# EAGLE schematic Control Board (EAGLE 6.2)
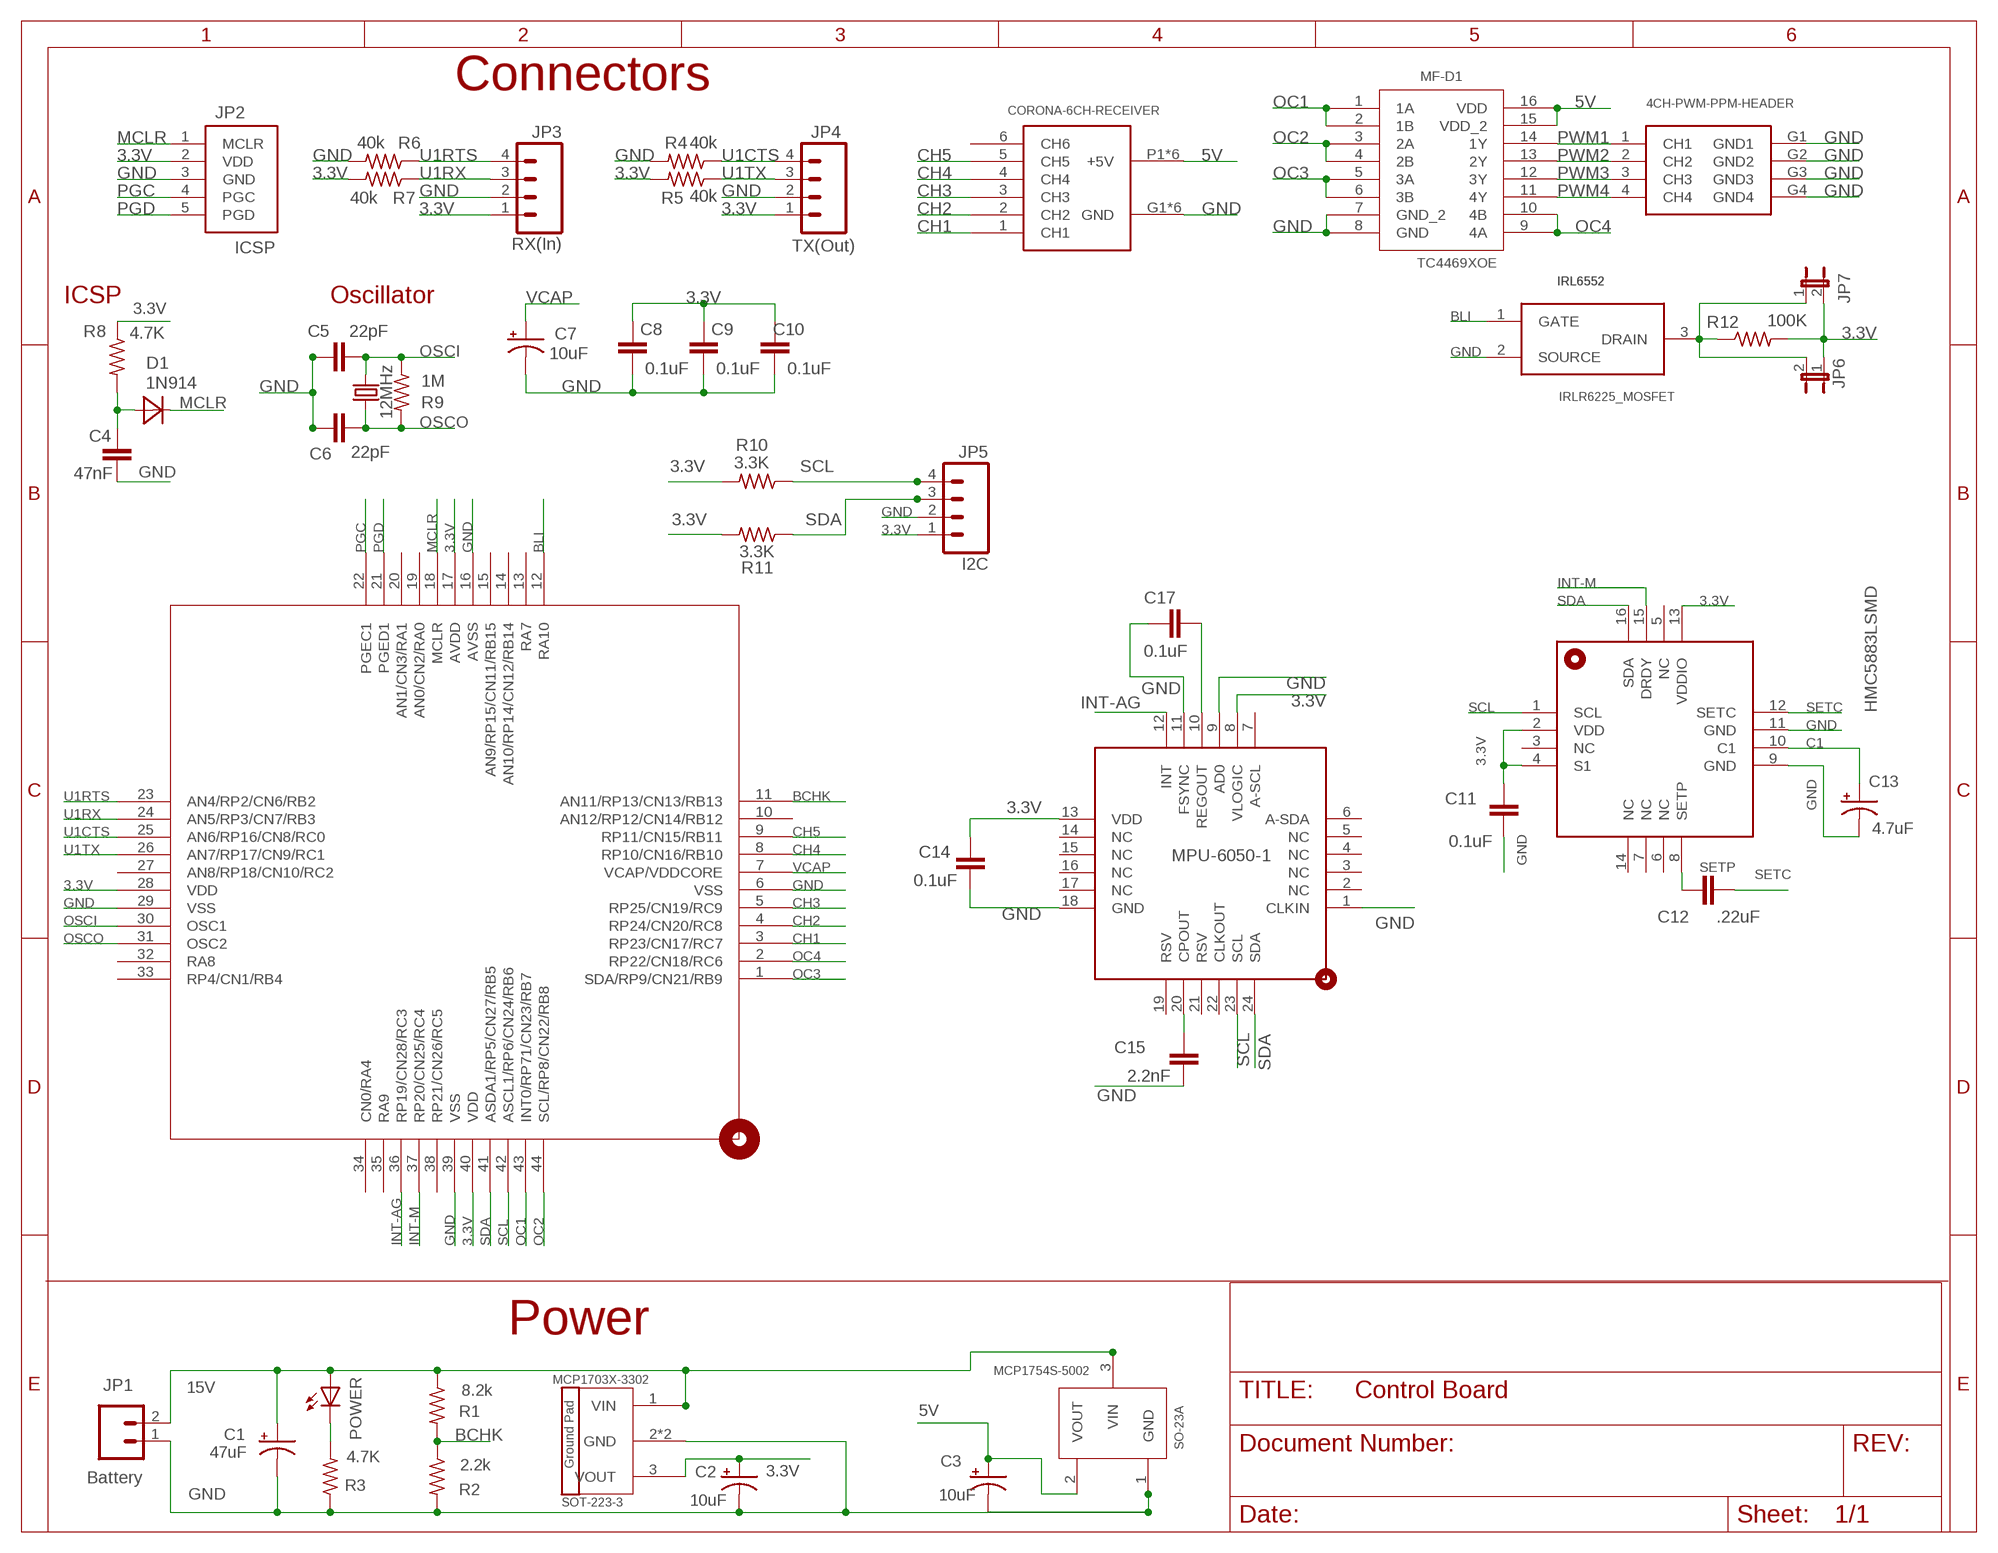
[diagram p0: schematic, sheet 1]

## Parts
C1  47uF  CPOL-USE2-5  [E2-5]
C2  10uF  CPOL-USE2-5  [E2-5]
C3  10uF  CPOL-USE2-5  [E2-5]
C4  47nF  CAPACITOR  [CAP-SMALL-2MM-SMALLPAD]
C5  22pF  CAPACITOR  [CAP-SMALL-2MM-SMALLPAD]
C6  22pF  CAPACITOR  [CAP-SMALL-2MM-SMALLPAD]
C7  10uF  CPOL-USE2-5  [E2-5]
C8  0.1uF  CAPACITOR  [CAP-SMALL-2MM-SMALLPAD]
C9  0.1uF  CAPACITOR  [CAP-SMALL-2MM-SMALLPAD]
C10  0.1uF  CAPACITOR  [CAP-SMALL-2MM-SMALLPAD]
C11  0.1uF  CAPACITOR  [CAP-SMALL-2MM-SMALLPAD]
C12  .22uF  C-EU050-024X044  [C050-024X044]
C13  4.7uF  CPOL-USE2-5  [E2-5]
C14  0.1uF  CAPACITOR  [CAP-SMALL-2MM-SMALLPAD]
C15  2.2nF  CAPACITOR  [CAP-SMALL-2MM-SMALLPAD]
C17  0.1uF  CAPACITOR  [CAP-SMALL-2MM-SMALLPAD]
CR1  CORONA-6CH-RECEIVER  [CORONA-6CH-RECEIVER-FOOTPRINT]
D1  1N914  [DO34-5]
IRL6552  IRLR6225_MOSFET  [TO252]
JP1  Battery  M02  [1X02_LONGPADS]
JP2  ICSP  ICSPPADS  [ICSP_LOCK_LONGPADS]
JP3  RX(In)  M04LOCK_LONGPADS  [1X04_LOCK_LONGPADS]
JP4  TX(Out)  M04LOCK_LONGPADS  [1X04_LOCK_LONGPADS]
JP5  I2C  M04LOCK_LONGPADS  [1X04_LOCK_LONGPADS]
JP6  JUMPER-2PTH_LOCK  [1X02_LOCK]
JP7  JUMPER-2PTH_LOCK  [1X02_LOCK]
MCP1703X-3302  SOT-223-3  MCP1703X-XXXXX/D  [SOT-223_3MC]
MCP1754S-5002  SO-23A  MCP1703X-XXXXX/C  [SOT-23A_MC]
MF-D1  TC4469XOE  [SOIC16_W_MC]
POWER  LED3MM  [LED3MM]
PWM-PPM  4CH-PWM-PPM-HEADER  [4CH-PWM-PPM-HEADER-PACKAGE]
Q1  12MHz  CRYSTALHC49US  [HC49US]
R1  8.2k  R-US_0204/7  [0204/7]
R2  2.2k  R-US_0204/7  [0204/7]
R3  4.7K  R-US_0204/7  [0204/7]
R4  40k  R-US_0204/7  [0204/7]
R5  40k  R-US_0204/7  [0204/7]
R6  40k  R-US_0204/7  [0204/7]
R7  40k  R-US_0204/7  [0204/7]
R8  4.7K  R-US_0204/7  [0204/7]
R9  1M  R-US_0204/7  [0204/7]
R10  3.3K  R-US_0204/7  [0204/7]
R11  3.3K  R-US_0204/7  [0204/7]
R12  100K  R-US_0204/7  [0204/7]
U1  HMC5883LSMD  [HMC5883L-16LPCC]
U$1  MPU-6050-1  [MPU-6050_QFN-24-4MM2_AZ]
U$3  PIC24HJ128GP204_AZ  [TQFP44_10X10MC]

## Nets
3.3V [PWR]: C2.+ C8.1 C9.1 C10.1 C11.2 C14.1 JP2.2(VDD) JP3.1 JP4.1 JP5.1 JP6.1 JP7.2 MCP1703X-3302.3(VOUT) R5.2 R7.2 R8.1 R10.2 R11.2 R12.2 U1.2(VDD) U1.4(S1) U1.13(VDDIO) U$1.8(VLOGIC) U$1.13(VDD) U$3.17(AVDD) U$3.28(VDD) U$3.40(VDD)
5V [PWR]: C3.+ CR1.P1(+5V) CR1.P2(+5V) CR1.P3(+5V) CR1.P4(+5V) CR1.P5(+5V) CR1.P6(+5V) MCP1754S-5002.2(VOUT) MF-D1.15(VDD_2) MF-D1.16(VDD)
15V [15V]: C1.+ JP1.2 MCP1703X-3302.1(VIN) MCP1754S-5002.3(VIN) POWER.A R1.1
BCHK: R1.2 R2.1 U$3.11(AN11/RP13/CN13/RB13)
BLI: IRL6552.1(GATE) U$3.12(RA10)
C1: C13.+ U1.10(C1)
CH1: CR1.1(CH1) U$3.3(RP23/CN17/RC7)
CH2: CR1.2(CH2) U$3.4(RP24/CN20/RC8)
CH3: CR1.3(CH3) U$3.5(RP25/CN19/RC9)
CH4: CR1.4(CH4) U$3.8(RP10/CN16/RB10)
CH5: CR1.5(CH5) U$3.9(RP11/CN15/RB11)
GND: C1.- C2.- C3.- C4.2 C5.1 C6.1 C7.- C8.2 C9.2 C10.2 C11.1 C13.- C14.2 C15.2 C17.1 CR1.G1(GND) CR1.G2(GND) CR1.G3(GND) CR1.G4(GND) CR1.G5(GND) CR1.G6(GND) IRL6552.2(SOURCE) JP1.1 JP2.3(GND) JP3.2 JP4.2 JP5.2 MCP1703X-3302.2(GND) MCP1703X-3302.4(GND) MCP1754S-5002.1(GND) MF-D1.7(GND_2) MF-D1.8(GND) PWM-PPM.G1(GND1) PWM-PPM.G2(GND2) PWM-PPM.G3(GND3) PWM-PPM.G4(GND4) R2.2 R3.1 R4.2 R6.2 U1.9(GND) U1.11(GND) U$1.1(CLKIN) U$1.9(AD0) U$1.11(FSYNC) U$1.18(GND) U$3.6(VSS) U$3.16(AVSS) U$3.29(VSS) U$3.39(VSS)
INT-AG: U$1.12(INT) U$3.36(RP19/CN28/RC3)
INT-M: U1.15(DRDY) U$3.37(RP20/CN25/RC4)
MCLR: D1.C JP2.1(MCLR) U$3.18(MCLR)
N$1: C4.1 D1.A R8.2
N$2: IRL6552.3(DRAIN) JP6.2 JP7.1 R12.1
N$3: C17.2 U$1.10(REGOUT)
N$5: POWER.K(C) R3.2
N$6: C15.1 U$1.20(CPOUT)
OC1: MF-D1.1(1A) MF-D1.2(1B) U$3.43(INT0/RP71/CN23/RB7)
OC2: MF-D1.3(2A) MF-D1.4(2B) U$3.44(SCL/RP8/CN22/RB8)
OC3: MF-D1.5(3A) MF-D1.6(3B) U$3.1(SDA/RP9/CN21/RB9)
OC4: MF-D1.9(4A) MF-D1.10(4B) U$3.2(RP22/CN18/RC6)
OSCI: C5.2 Q1.2 R9.1 U$3.30(OSC1)
OSCO: C6.2 Q1.1 R9.2 U$3.31(OSC2)
PGC: JP2.4(PGC) U$3.22(PGEC1)
PGD: JP2.5(PGD) U$3.21(PGED1)
PWM1: MF-D1.14(1Y) PWM-PPM.1(CH1)
PWM2: MF-D1.13(2Y) PWM-PPM.2(CH2)
PWM3: MF-D1.12(3Y) PWM-PPM.3(CH3)
PWM4: MF-D1.11(4Y) PWM-PPM.4(CH4)
SCL: JP5.4 R10.1 U1.1(SCL) U$1.23(SCL) U$3.42(ASCL1/RP6/CN24/RB6)
SDA: JP5.3 R11.1 U1.16(SDA) U$1.24(SDA) U$3.41(ASDA1/RP5/CN27/RB5)
SETC: C12.2 U1.12(SETC)
SETP: C12.1 U1.8(SETP)
U1CTS: JP4.4 R4.1 U$3.25(AN6/RP16/CN8/RC0)
U1RTS: JP3.4 R6.1 U$3.23(AN4/RP2/CN6/RB2)
U1RX: JP3.3 R7.1 U$3.24(AN5/RP3/CN7/RB3)
U1TX: JP4.3 R5.1 U$3.26(AN7/RP17/CN9/RC1)
VCAP: C7.+ U$3.7(VCAP/VDDCORE)
Unconnected: CR1.6(CH6) U1.3(NC) U1.5(NC) U1.6(NC) U1.7(NC) U1.14(NC) U$1.2(NC) U$1.3(NC) U$1.4(NC) U$1.5(NC) U$1.6(A-SDA) U$1.7(A-SCL) U$1.14(NC) U$1.15(NC) U$1.16(NC) U$1.17(NC) U$1.19(RSV) U$1.21(RSV) U$1.22(CLKOUT) U$3.10(AN12/RP12/CN14/RB12) U$3.13(RA7) U$3.14(AN10/RP14/CN12/RB14) U$3.15(AN9/RP15/CN11/RB15) U$3.19(AN0/CN2/RA0) U$3.20(AN1/CN3/RA1) U$3.27(AN8/RP18/CN10/RC2) U$3.32(RA8) U$3.33(RP4/CN1/RB4) U$3.34(CN0/RA4) U$3.35(RA9) U$3.38(RP21/CN26/RC5)

## Notes on the sheet
- Connectors
- ICSP | Oscillator
- Power

## Library data of the parts
C1-C3 C7 C13 = rcl:CPOL-US: POLARIZED CAPACITOR, American symbol
C4-C6 C8-C11 C14 C15 C17 = AZ Custom:CAPACITOR: Capacitor Standard 0603 ceramic capacitor, and 0.1" leaded capacitor.
C12 = rcl:C-EU: CAPACITOR, European symbol
CR1 = AZ Custom:CORONA-6CH-RECEIVER
D1 = AZ Custom:1N914
IRL6552 = AZ Custom:IRLR6225_MOSFET
JP1 = SparkFun:M02: Header 2 Standard 2-pin 0.1" header. Use with straight break away headers (SKU : PRT-00116), right angle break away headers (PRT-00553), swiss pins (PRT-00743), machine pins (PRT-00117), and female headers (PRT-00115). Molex polarized connector foot print use with SKU : PRT-08233 with associated crimp pins and housings.
JP2 = AZ Custom:ICSP
JP3-JP5 = SparkFun:M04: Header 4 Standard 4-pin 0.1" header. Use with straight break away headers (SKU : PRT-00116), right angle break away headers (PRT-00553), swiss pins (PRT-00743), machine pins (PRT-00117), and female headers (PRT-00115). Molex polarized connector foot print use with SKU : PRT-08231 with associated crimp pins and housings.
JP6 JP7 = SparkFun:JUMPER-2: Jumper Basic 0.1" spaced jumper. Use with breakaway headers.
MCP1703X-3302 = AZ Custom:MCP1703X-XXXXX/D
MCP1754S-5002 = AZ Custom:MCP1703X-XXXXX/C
MF-D1 = AZ Custom:TC4469XOE
POWER = AZ Custom:LED: LEDs Standard schematic elements and footprints for 5mm, 3mm, 1206, and 0603 sized LEDs. 5mm - Spark Fun Electronics SKU : COM-00529 (and others)
PWM-PPM = AZ Custom:4CH-PWM-PPM-HEADER
Q1 = SparkFun:CRYSTAL: Crystals Various standard crystals. Proven footprints. Spark Fun Electronics SKU : COM-00534
R1-R12 = resistor:R-US_: RESISTOR, American symbol
U1 = AZ Custom:HMC5883L: 3 Axis Digital Compass IC
U$1 = AZ Custom:MPU-6050
U$3 = AZ Custom:PIC24HJ128GP204_AZ

## Net classes
1 15V: width 0.254 mm, clearance 0.254 mm
2 PWR: width 0.254 mm, clearance 0.254 mm